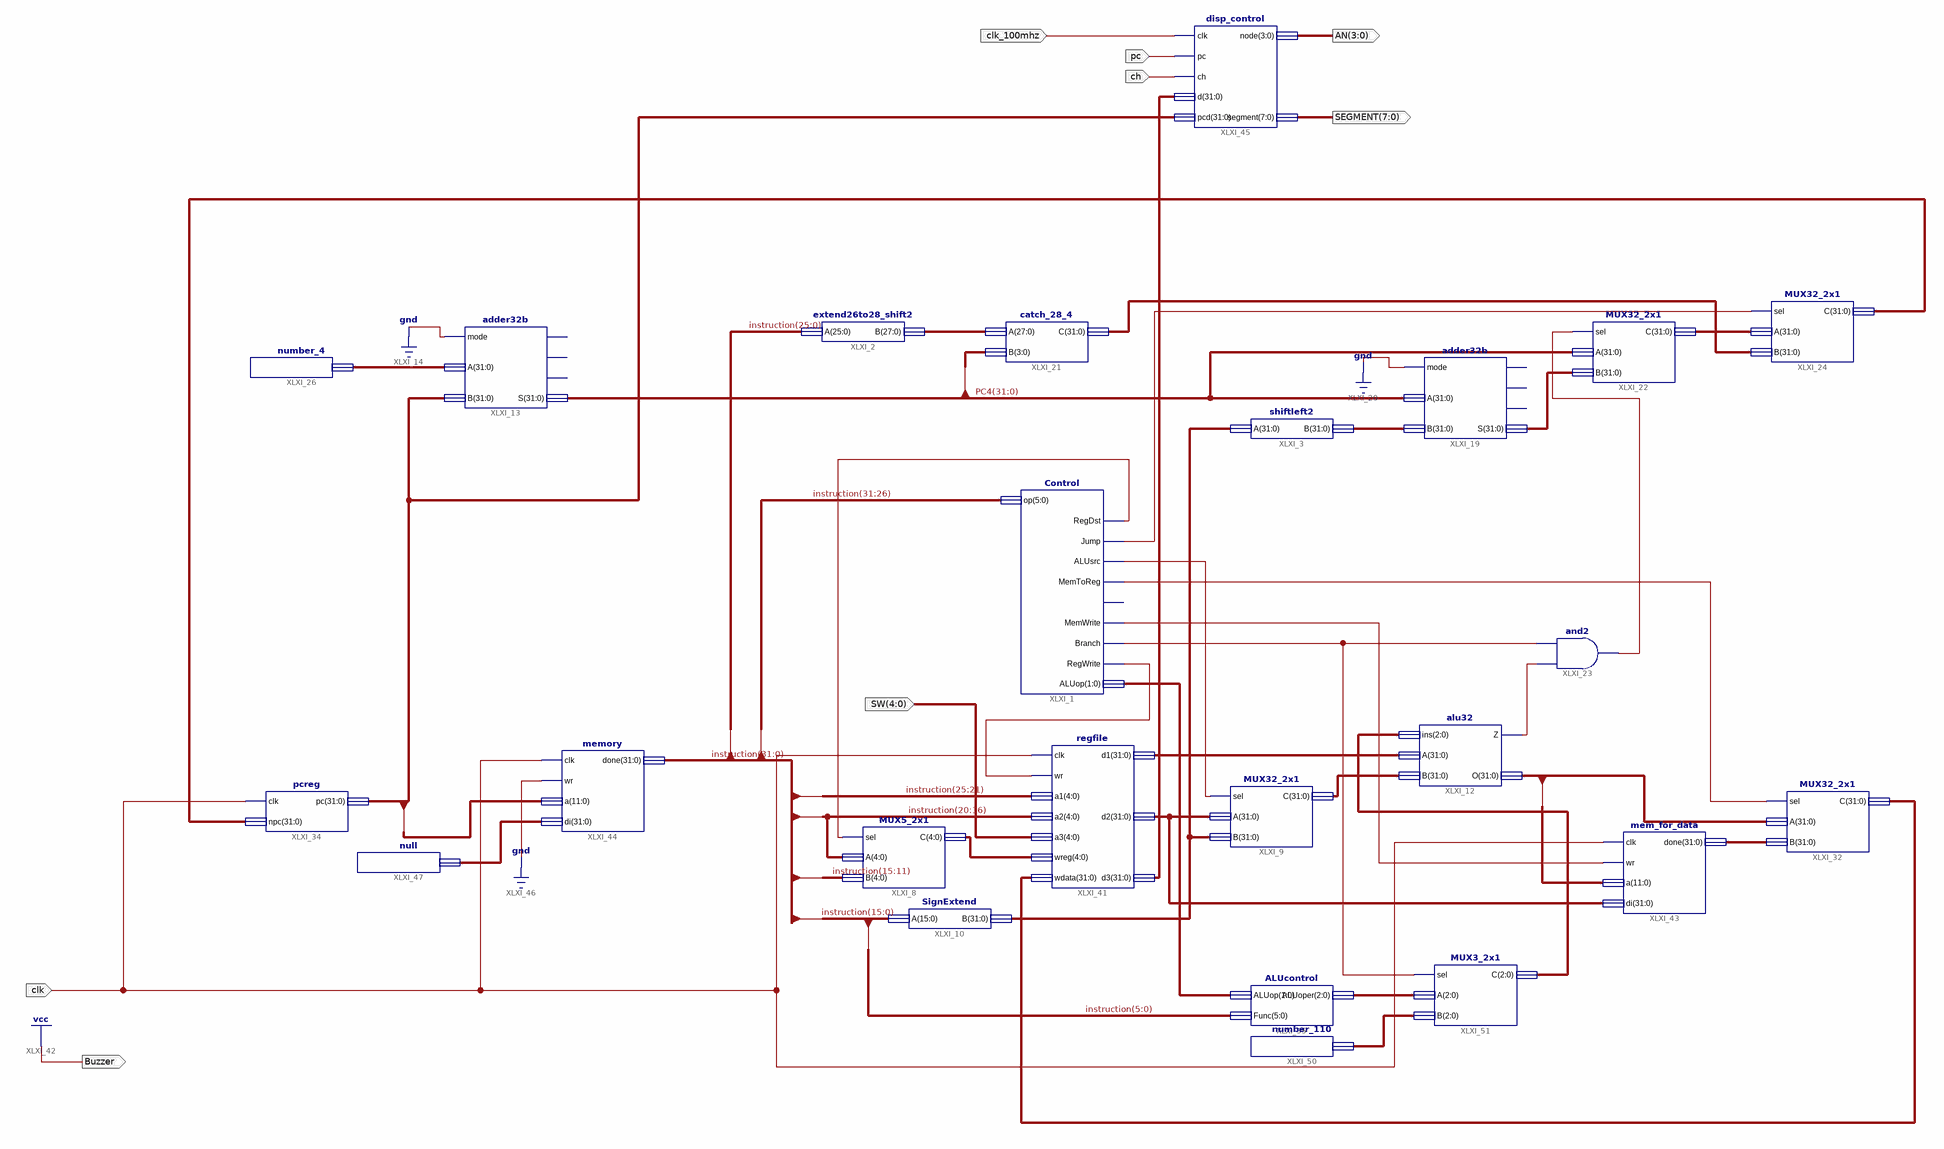
[diagram p0: schematic sheet 1]
// Xilinx ISE schematic top_for_single.sch (kintex7) as structural Verilog: 24 symbols, 8 ports
module top_for_single (
  input  clk,
  input  clk_100mhz,
  input  pc,
  input  ch,
  input  [4:0] SW,
  output Buzzer,
  output [3:0] AN,
  output [7:0] SEGMENT
);

  wire XLXN_13, XLXN_20, XLXN_23, XLXN_48, XLXN_53, XLXN_54, XLXN_68, XLXN_71, XLXN_93;
  wire [1:0] XLXN_25;
  wire [2:0] XLXN_94, XLXN_95, XLXN_96;
  wire [4:0] XLXN_16;
  wire [27:0] XLXN_43;
  wire [31:0] addr, digit, instruction, PC4, pc_bus, XLXN_22, XLXN_24, XLXN_28, XLXN_39, XLXN_46, XLXN_55,
       XLXN_56, XLXN_59, XLXN_65, XLXN_70, XLXN_72, XLXN_77, XLXN_90;

  Control XLXI_1 (
    .op(instruction[31:26]), .RegDst(XLXN_13), .Jump(XLXN_54), .ALUsrc(XLXN_23), .MemToReg(XLXN_71),
    .MemWrite(XLXN_68), .Branch(XLXN_93), .RegWrite(XLXN_20), .ALUop(XLXN_25));  // open: MemRead
  extend26to28_shift2 XLXI_2 (.A(instruction[25:0]), .B(XLXN_43));
  shiftleft2 XLXI_3 (.A(XLXN_22), .B(XLXN_39));
  MUX5_2x1 XLXI_8 (.sel(XLXN_13), .A(instruction[20:16]), .B(instruction[15:11]), .C(XLXN_16));
  MUX32_2x1 XLXI_9 (.sel(XLXN_23), .A(digit), .B(XLXN_22), .C(XLXN_28));
  SignExtend XLXI_10 (.A(instruction[15:0]), .B(XLXN_22));
  alu32 XLXI_12 (.ins(XLXN_96), .A(XLXN_24), .B(XLXN_28), .Z(XLXN_48), .O(addr));
  adder32b XLXI_13 (.mode(1'b0), .A(XLXN_59), .B(pc_bus), .S(PC4));  // open: CF, SF, ZF
  adder32b XLXI_19 (.mode(1'b0), .A(PC4), .B(XLXN_39), .S(XLXN_46));  // open: CF, SF, ZF
  catch_28_4 XLXI_21 (.A(XLXN_43), .B(PC4[31:28]), .C(XLXN_55));
  MUX32_2x1 XLXI_22 (.sel(XLXN_53), .A(PC4), .B(XLXN_46), .C(XLXN_56));
  and XLXI_23 (XLXN_53, XLXN_48, XLXN_93);
  MUX32_2x1 XLXI_24 (.sel(XLXN_54), .A(XLXN_56), .B(XLXN_55), .C(XLXN_65));
  number_4 XLXI_26 (.num(XLXN_59));
  MUX32_2x1 XLXI_32 (.sel(XLXN_71), .A(addr), .B(XLXN_70), .C(XLXN_72));
  pcreg XLXI_34 (.clk(clk), .npc(XLXN_65), .pc(pc_bus));
  ALUcontrol XLXI_35 (.ALUop(XLXN_25), .Func(instruction[5:0]), .ALUoper(XLXN_95));
  regfile XLXI_41 (
    .clk(clk), .wr(XLXN_20), .a1(instruction[25:21]), .a2(instruction[20:16]), .a3(SW), .wreg(XLXN_16),
    .wdata(XLXN_72), .d1(XLXN_24), .d2(digit), .d3(XLXN_77));
  mem_for_data XLXI_43 (.clk(clk), .wr(XLXN_68), .a(addr[11:0]), .di(digit), .done(XLXN_70));
  memory XLXI_44 (.clk(clk), .wr(1'b0), .a(pc_bus[11:0]), .di(XLXN_90), .done(instruction));
  disp_control XLXI_45 (.clk(clk_100mhz), .pc(pc), .ch(ch), .d(XLXN_77), .pcd(pc_bus), .node(AN), .segment(SEGMENT));
  \null  XLXI_47 (.A(XLXN_90));
  number_110 XLXI_50 (.A(XLXN_94));
  MUX3_2x1 XLXI_51 (.sel(XLXN_93), .A(XLXN_95), .B(XLXN_94), .C(XLXN_96));

  assign Buzzer = 1'b1;
endmodule
